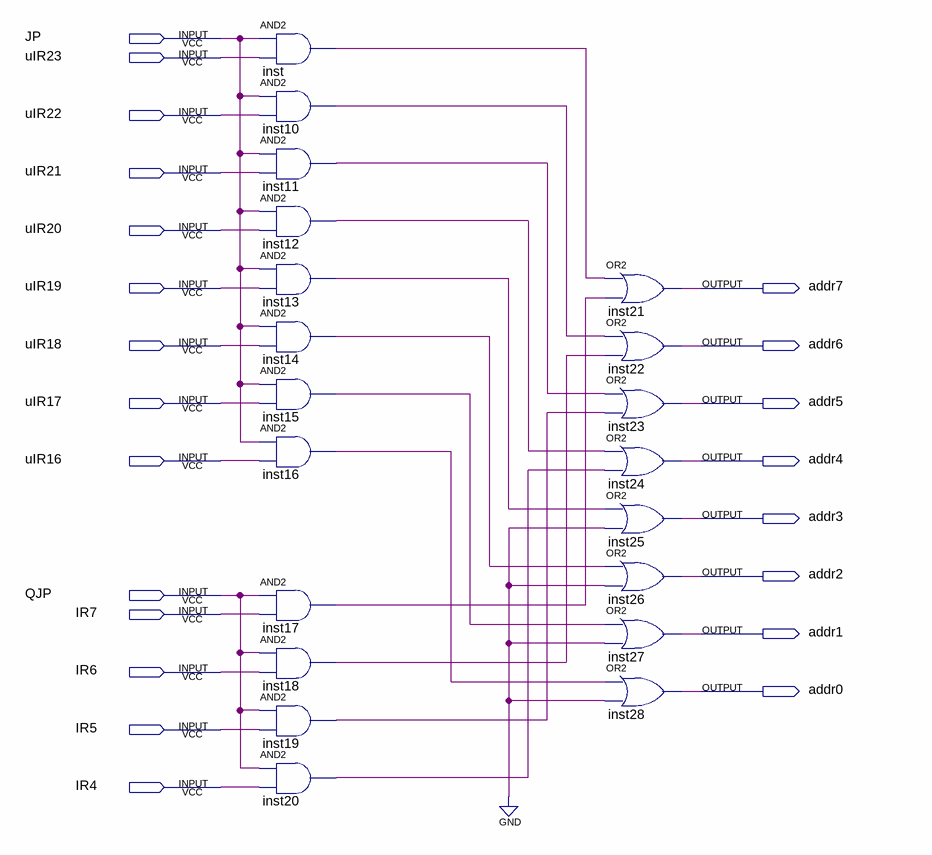
[diagram p0: schematic sheet]
// Quartus schematic uAddr.bdf as structural Verilog: 20 symbols, 22 pins
module uAddr (
  input  JP,
  input  uIR23,
  input  uIR22,
  input  uIR21,
  input  uIR20,
  input  uIR19,
  input  uIR18,
  input  uIR17,
  input  uIR16,
  input  QJP,
  input  IR7,
  input  IR6,
  input  IR5,
  input  IR4,
  output addr7,
  output addr6,
  output addr5,
  output addr4,
  output addr3,
  output addr2,
  output addr1,
  output addr0
);

  wire inst10_out, inst11_out, inst12_out, inst13_out, inst14_out, inst15_out, inst16_out, inst17_out,
       inst18_out, inst19_out, inst20_out, inst_out;

  and inst (inst_out, JP, uIR23);
  and inst10 (inst10_out, JP, uIR22);
  and inst11 (inst11_out, JP, uIR21);
  and inst12 (inst12_out, JP, uIR20);
  and inst13 (inst13_out, JP, uIR19);
  and inst14 (inst14_out, JP, uIR18);
  and inst15 (inst15_out, JP, uIR17);
  and inst16 (inst16_out, JP, uIR16);
  and inst17 (inst17_out, QJP, IR7);
  and inst18 (inst18_out, QJP, IR6);
  and inst19 (inst19_out, QJP, IR5);
  and inst20 (inst20_out, QJP, IR4);
  or inst21 (addr7, inst_out, inst17_out);
  or inst22 (addr6, inst10_out, inst18_out);
  or inst23 (addr5, inst11_out, inst19_out);
  or inst24 (addr4, inst12_out, inst20_out);
  or inst25 (addr3, inst13_out, 1'b0);
  or inst26 (addr2, inst14_out, 1'b0);
  or inst27 (addr1, inst15_out, 1'b0);
  or inst28 (addr0, inst16_out, 1'b0);
endmodule
